# EAGLE design v2 (EAGLE 9.5.2)
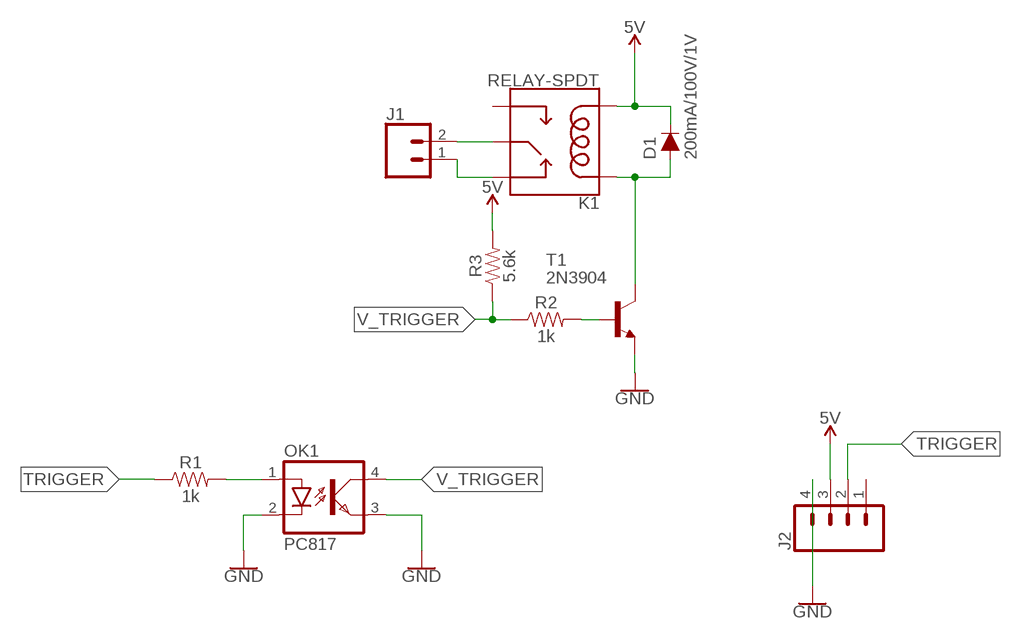
[diagram p0: schematic, sheet 1]

## Parts
D1  200mA/100V/1V  DIODE-KIT  [DIODE-1N4148-KIT]
J1  CONN_025MM  [SCREWTERMINAL-5MM-2]
J2  CONN_04  [1X04]
K1  RELAY-SPDT  [RELAY_G5LE]
OK1  PC817  [DIL04]
R1  1k  1KOHM-HORIZ-1/4W-1%  [AXIAL-0.3]
R2  1k  1KOHM-HORIZ-1/4W-1%  [AXIAL-0.3]
R3  5.6k  1KOHM-HORIZ-1/4W-1%  [AXIAL-0.3]
T1  2N3904  [TO92]

## Nets
5V: D1.C J2.3 K1.5(COIL2) R3.P$2
GND: J2.4 OK1.2(C) OK1.3(EMIT) T1.3(E)
N$1: OK1.1(A) R1.P$2
N$2: J1.2 K1.1(MAIN)
N$3: J1.1 K1.4(NC)
N$4: R2.P$2 T1.2(B)
N$5: D1.A K1.2(COIL1) T1.1(C)
TRIGGER: J2.2 R1.P$1
V_TRIGGER: OK1.4(COL) R2.P$1 R3.P$1
Unconnected: J2.1 K1.3(NO)

## Library data of the parts
D1 = SparkFun-DiscreteSemi:DIODE: Diode These are standard reverse protection diodes and small signal diodes. SparkFun Products: SparkFun SparkPunk Sound Kit <https://www.sparkfun.com/products/11177> SparkFun ESP8266 Thing <https://www.sparkfun.com/products/13231>; PROD_ID: DIO-08378
J1 = SparkFun-Connectors:CONN_02: Multi connection point. Often used as Generic Header-pin footprint for 0.1 inch spaced/style header connections On any of the 0.1 inch spaced packages, you can populate with these: Break Away Headers - Straight <https://www.sparkfun.com/products/116> (PRT-00116) Break Away Male Headers - Right Angle <https://www.sparkfun.com/products/553> (PRT-00553) Female Headers <https://www.sparkfun.com/products/115> (PRT-00115) Break Away Headers - Machine Pin <https://www.sparkfun.com/products/117> (PRT-00117) Break Away Female Headers - Swiss Machine Pin <https://www.sparkfun.com/products/743> (PRT-00743) For SCREWTERMINALS and SPRING TERMINALS visit here: Screw Terimnals on SparkFun.com <https://www.sparkfun.com/search/results?term=Screw+Terminals> (5mm/3.5mm/2.54mm spacing) This device is also useful as a general connection point to wire up your design to another part of your project. Our various solder wires solder well into these plated through hole pads. Hook-Up Wire - Assortment (Stranded, 22 AWG) <https://www.sparkfun.com/products/11375> (PRT-11375) Hook-Up Wire - Assortment (Solid Core, 22 AWG) <https://www.sparkfun.com/products/11367> (PRT-11367) View the entire wire category on our website here <https://www.sparkfun.com/categories/141> Special notes: Molex polarized connector foot print use with: PRT-08233 with associated crimp pins and housings. 2.54_SCREWTERM for use with PRT-10571. 3.5mm Screw Terminal footprints for PRT-08084 5mm Screw Terminal footprints for use with PRT-08432; SF_SKU: PRT-08432
J2 = SparkFun-Connectors:CONN_04: Multi connection point. Often used as Generic Header-pin footprint for 0.1 inch spaced/style header connections On any of the 0.1 inch spaced packages, you can populate with these: Break Away Headers - Straight <https://www.sparkfun.com/products/116> (PRT-00116) Break Away Male Headers - Right Angle <https://www.sparkfun.com/products/553> (PRT-00553) Female Headers <https://www.sparkfun.com/products/115> (PRT-00115) Break Away Headers - Machine Pin <https://www.sparkfun.com/products/117> (PRT-00117) Break Away Female Headers - Swiss Machine Pin <https://www.sparkfun.com/products/743> (PRT-00743) For SCREWTERMINALS and SPRING TERMINALS visit here: Screw Terimnals on SparkFun.com <https://www.sparkfun.com/search/results?term=Screw+Terminals> (5mm/3.5mm/2.54mm spacing) This device is also useful as a general connection point to wire up your design to another part of your project. Our various solder wires solder well into these plated through hole pads. Hook-Up Wire - Assortment (Stranded, 22 AWG) <https://www.sparkfun.com/products/11375> (PRT-11375) Hook-Up Wire - Assortment (Solid Core, 22 AWG) <https://www.sparkfun.com/products/11367> (PRT-11367) View the entire wire category on our website here <https://www.sparkfun.com/categories/141> Special notes: Molex polarized connector foot print use with SKU : PRT-08231 with associated crimp pins and housings. 1MM SMD Version SKU: PRT-10208; PROD_ID: CONN-09696
K1 = SparkFun-Electromechanical:RELAY-SPDT: SPDT Electromechanical Relay Single-pole, double-throw sealed relays. When current is applied to the coil, it throws a simple changeover switch, terminating the connection from the NC contact to ground and closing the NO contact. Use them to switch high voltage/high current devices. SparkFun Products JQX-15F: Relay SPDT Sealed - 20A <https://www.sparkfun.com/products/10924> (COM-10924) JZC-11F: Relay SPDT Sealed <https://www.sparkfun.com/products/100> (COM-00100); PROD_ID: COMP-14214
OK1 = optocoupler:PC817: SHARP OPTO COUPLER; MPN: PC817X4J000F; OC_FARNELL: 9707727; OC_NEWARK: 97K7059
R1 R2 = SparkFun-Resistors:1KOHM: 1kΩ resistor A resistor is a passive two-terminal electrical component that implements electrical resistance as a circuit element. Resistors act to reduce current flow, and, at the same time, act to lower voltage levels within circuits. - Wikipedia; PROD_ID: RES-12182
R3 = SparkFun-Resistors:1KOHM: 1kΩ resistor A resistor is a passive two-terminal electrical component that implements electrical resistance as a circuit element. Resistors act to reduce current flow, and, at the same time, act to lower voltage levels within circuits. - Wikipedia; PROD_ID: RES-12182; VALUE: 1k
T1 = transistor:2N3904: NPN TRANSISTOR

## Board
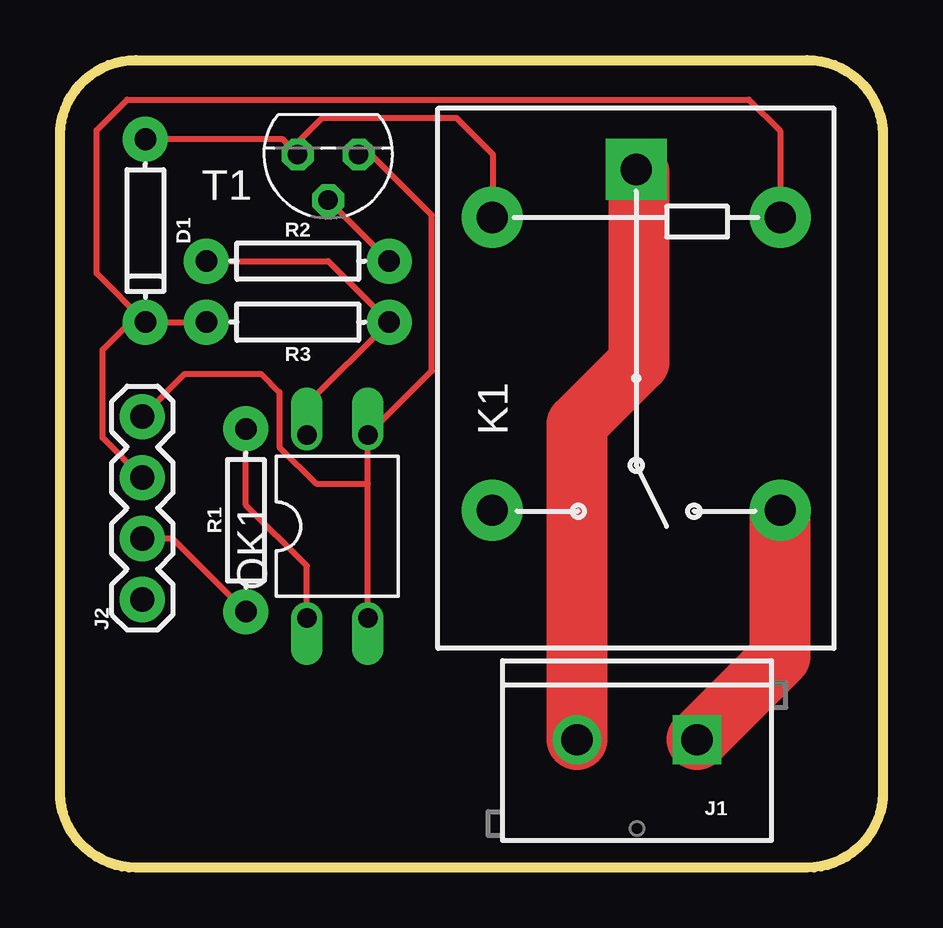
[diagram p1: board, top side]
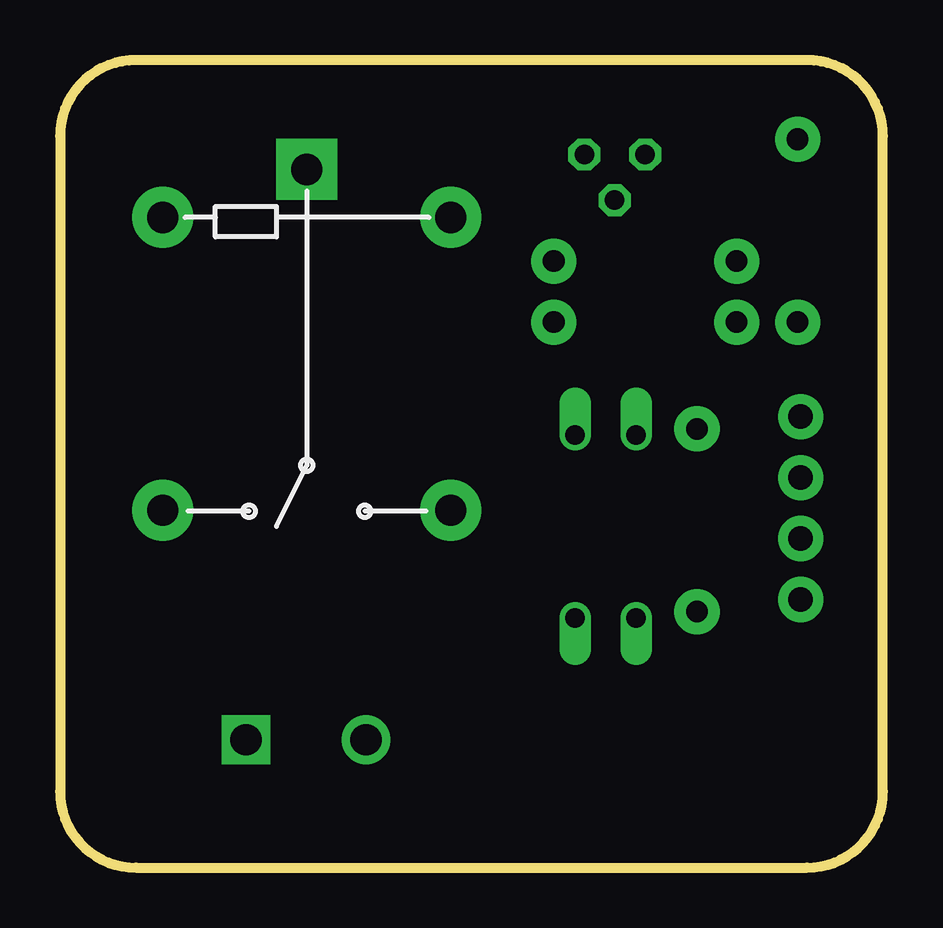
[diagram p2: board, bottom side, seen from below]

Size 34.29 x 33.66 mm. Coordinates in mm from the lower left corner, seen from the top.
Outline: 0,3.17 0,30.48 arc-90 3.17,33.66 31.11,33.66 arc-90 34.29,30.48 34.29,3.17 arc-90 31.11,0 3.17,0 arc-90 0,3.17
Copper layers (1*16): Top 0.035mm / dielectric 1.5mm / Bottom 0.035mm
Design rules "default": minimum track width 6mil, minimum drill 0.35mm, track to track 6mil, track to pad 6mil, pad to pad 6mil, via to via 6mil, smd to smd 6mil, copper to edge 40mil, drill to drill 6mil, minimum pad ring 10mil, minimum via ring 8mil, stop-mask expansion 4mil, vias tented up to drill 0mil, thermal gap 10mil

### Footprints (pad centres in the part's own frame; a part is rotated, then mirrored left to right if it is on the bottom)
DIODE-1N4148-KIT = drill 0.9 pad 1.88: A -3.81,0; C 3.81,0
SCREWTERMINAL-5MM-2 = drill 1.3 pad 2.032 square: 1 0,0 | drill 1.3 pad 2.032: 2 5,0
1X04 = drill 1.016 pad 1.88: 1 0,0; 2 2.54,0; 3 5.08,0; 4 7.62,0
RELAY_G5LE = drill 1.3 pad 2.54 square: 1 8.52,-0.005 | drill 1.3 pad 2.54: 2 6.52,5.995; 3 -5.68,5.995; 4 -5.68,-6.005; 5 6.52,-6.005
DIL04 = drill 0.813 offset: 1 -1.27,-3.81; 2 1.27,-3.81; 3 1.27,3.81; 4 -1.27,3.81
AXIAL-0.3 = drill 0.9 pad 1.88: P$1 -3.81,0; P$2 3.81,0
TO92 = drill 0.813 octagon: 1 1.27,0; 2 0,1.905; 3 -1.27,0

### Placement (x,y rotation side)
D1  3.56,26.54 270 top
J1  26.54,5.33 180 top
J2  3.43,11.18 90 top
K1  24,20.57 90 top
OK1  11.56,14.22 0 top
R1  7.75,14.48 90 top
R2  9.91,25.27 0 top
R3  9.91,22.73 180 top
T1  11.18,29.72 180 top

### Tracks (layer width: path | path; a pad name or v marks a point on that pad's centre or on a via)
5V
  Top 0.254: D1.C R3.P$2 | J2.3 1.78,17.91 1.78,21.59 2.92,22.73 D1.C | D1.C 1.52,24.77 1.52,30.73 2.79,32 28.7,32 30.01,30.7 K1.5
GND
  Top 0.254: T1.3 12.95,29.72 15.49,27.18 15.49,20.7 OK1.3 12.83,16 | OK1.2 12.83,16 | J2.4 5.21,20.57 8.38,20.57 9.14,19.81 9.14,17.53 10.67,16 12.83,16
N$1
  Top 0.254: OK1.1 10.29,12.57 7.75,15.11 R1.P$2
N$2
  Top 2.54: J1.2 21.54,18.5 24.13,21.08 24.13,28.97 K1.1
N$3
  Top 2.54: J1.1 30.01,8.8 K1.4
N$4
  Top 0.254: T1.2 R2.P$2
N$5
  Top 0.254: D1.A 9.27,30.35 T1.1 9.91,30.23 10.92,31.24 16.51,31.24 18.03,29.72 18.03,27.12 K1.2
TRIGGER
  Top 0.254: R1.P$1 4.7,13.72 J2.2
V_TRIGGER
  Top 0.254: R2.P$1 11.18,25.27 R3.P$1 10.29,19.3 OK1.4